# Altium schematic sheet FPC_Tran.SchDoc
size A4
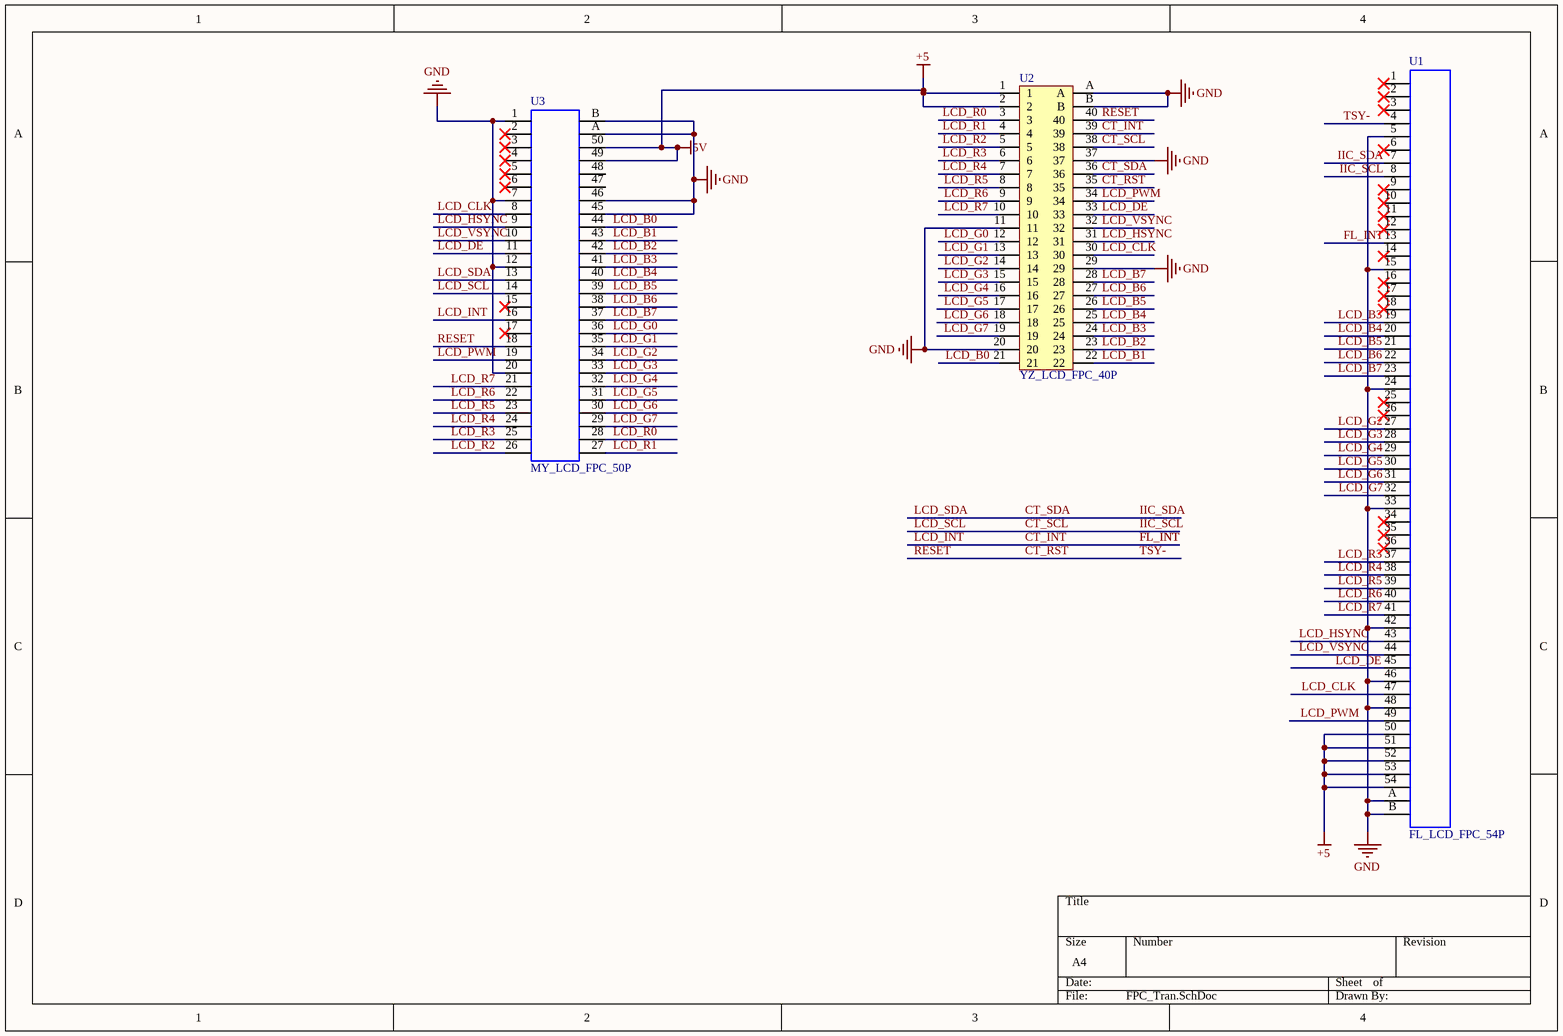
[diagram p0: FPC_Tran.SchDoc]

## Parts
U1  FL_LCD_FPC_54P  [FPC_0.5MM_54P]
U2  YZ_LCD_FPC_40P  [FPC_0.5mm_40P]
U3  MY_LCD_FPC_50P  [FPC_0.5MM_50P]

## Nets
+5: U1.50 U1.51 U1.52 U1.53 U1.54 U2.1 U2.2 U3.49 U3.50  [also labelled 5V]
GND: U1.5 U1.15 U1.24 U1.33 U1.42 U1.46 U1.48 U1.A U1.B U2.11 U2.20 U2.29 U2.37 U2.A U2.B U3.1 U3.7 U3.12 U3.20 U3.45 U3.46 U3.A U3.B
CT_INT: U1.13 U2.39 U3.16  [also labelled FL_INT, LCD_INT]
CT_RST: U1.4 U2.35 U2.40 U3.18  [also labelled RESET, TSY-]
CT_SCL: U1.8 U2.38 U3.14  [also labelled IIC_SCL, LCD_SCL]
CT_SDA: U1.7 U2.36 U3.13  [also labelled IIC_SDA, LCD_SDA]
LCD_B0: U2.21 U3.44
LCD_B1: U2.22 U3.43
LCD_B2: U2.23 U3.42
LCD_B3: U1.19 U2.24 U3.41
LCD_B4: U1.20 U2.25 U3.40
LCD_B5: U1.21 U2.26 U3.39
LCD_B6: U1.22 U2.27 U3.38
LCD_B7: U1.23 U2.28 U3.37
LCD_CLK: U1.47 U2.30 U3.8
LCD_DE: U1.45 U2.33 U3.11
LCD_G0: U2.12 U3.36
LCD_G1: U2.13 U3.35
LCD_G2: U1.27 U2.14 U3.34
LCD_G3: U1.28 U2.15 U3.33
LCD_G4: U1.29 U2.16 U3.32
LCD_G5: U1.30 U2.17 U3.31
LCD_G6: U1.31 U2.18 U3.30
LCD_G7: U1.32 U2.19 U3.29
LCD_HSYNC: U1.43 U2.31 U3.9
LCD_PWM: U1.49 U2.34 U3.19
LCD_R0: U2.3 U3.28
LCD_R1: U2.4 U3.27
LCD_R2: U2.5 U3.26
LCD_R3: U1.37 U2.6 U3.25
LCD_R4: U1.38 U2.7 U3.24
LCD_R5: U1.39 U2.8 U3.23
LCD_R6: U1.40 U2.9 U3.22
LCD_R7: U1.41 U2.10 U3.21
LCD_VSYNC: U1.44 U2.32 U3.10

Not connected (* = marked no-connect by the designer): U1 1* 2* 3* 6* 9* 10* 11* 12* 14* 16* 17* 18* 25* 26* 34* 35* 36*; U3 2* 3* 4* 5* 6* 15* 17* 47 48